# EAGLE schematic medipix (EAGLE 6.4)
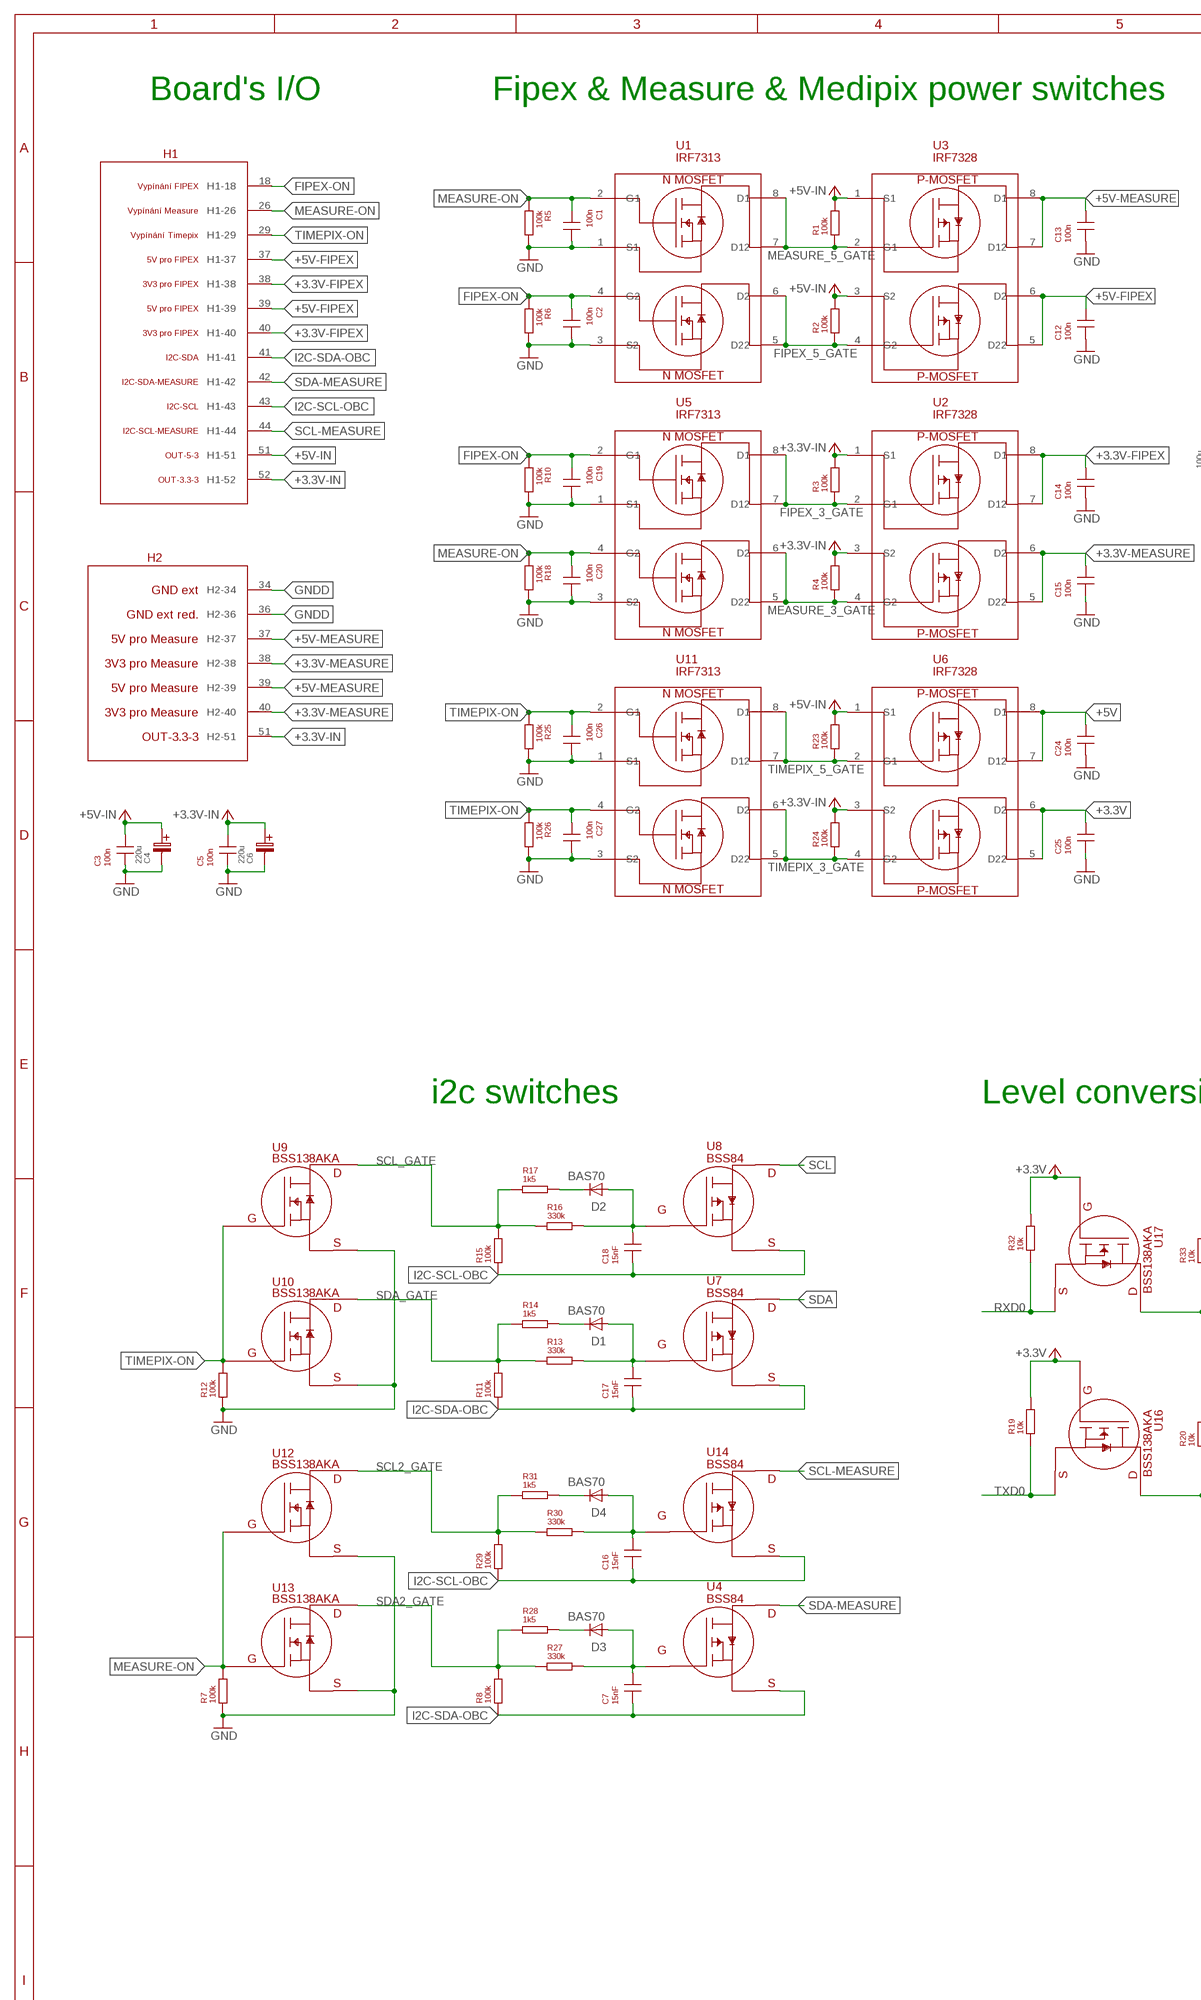
[diagram p0: schematic, sheet 1, part 1 of 2]
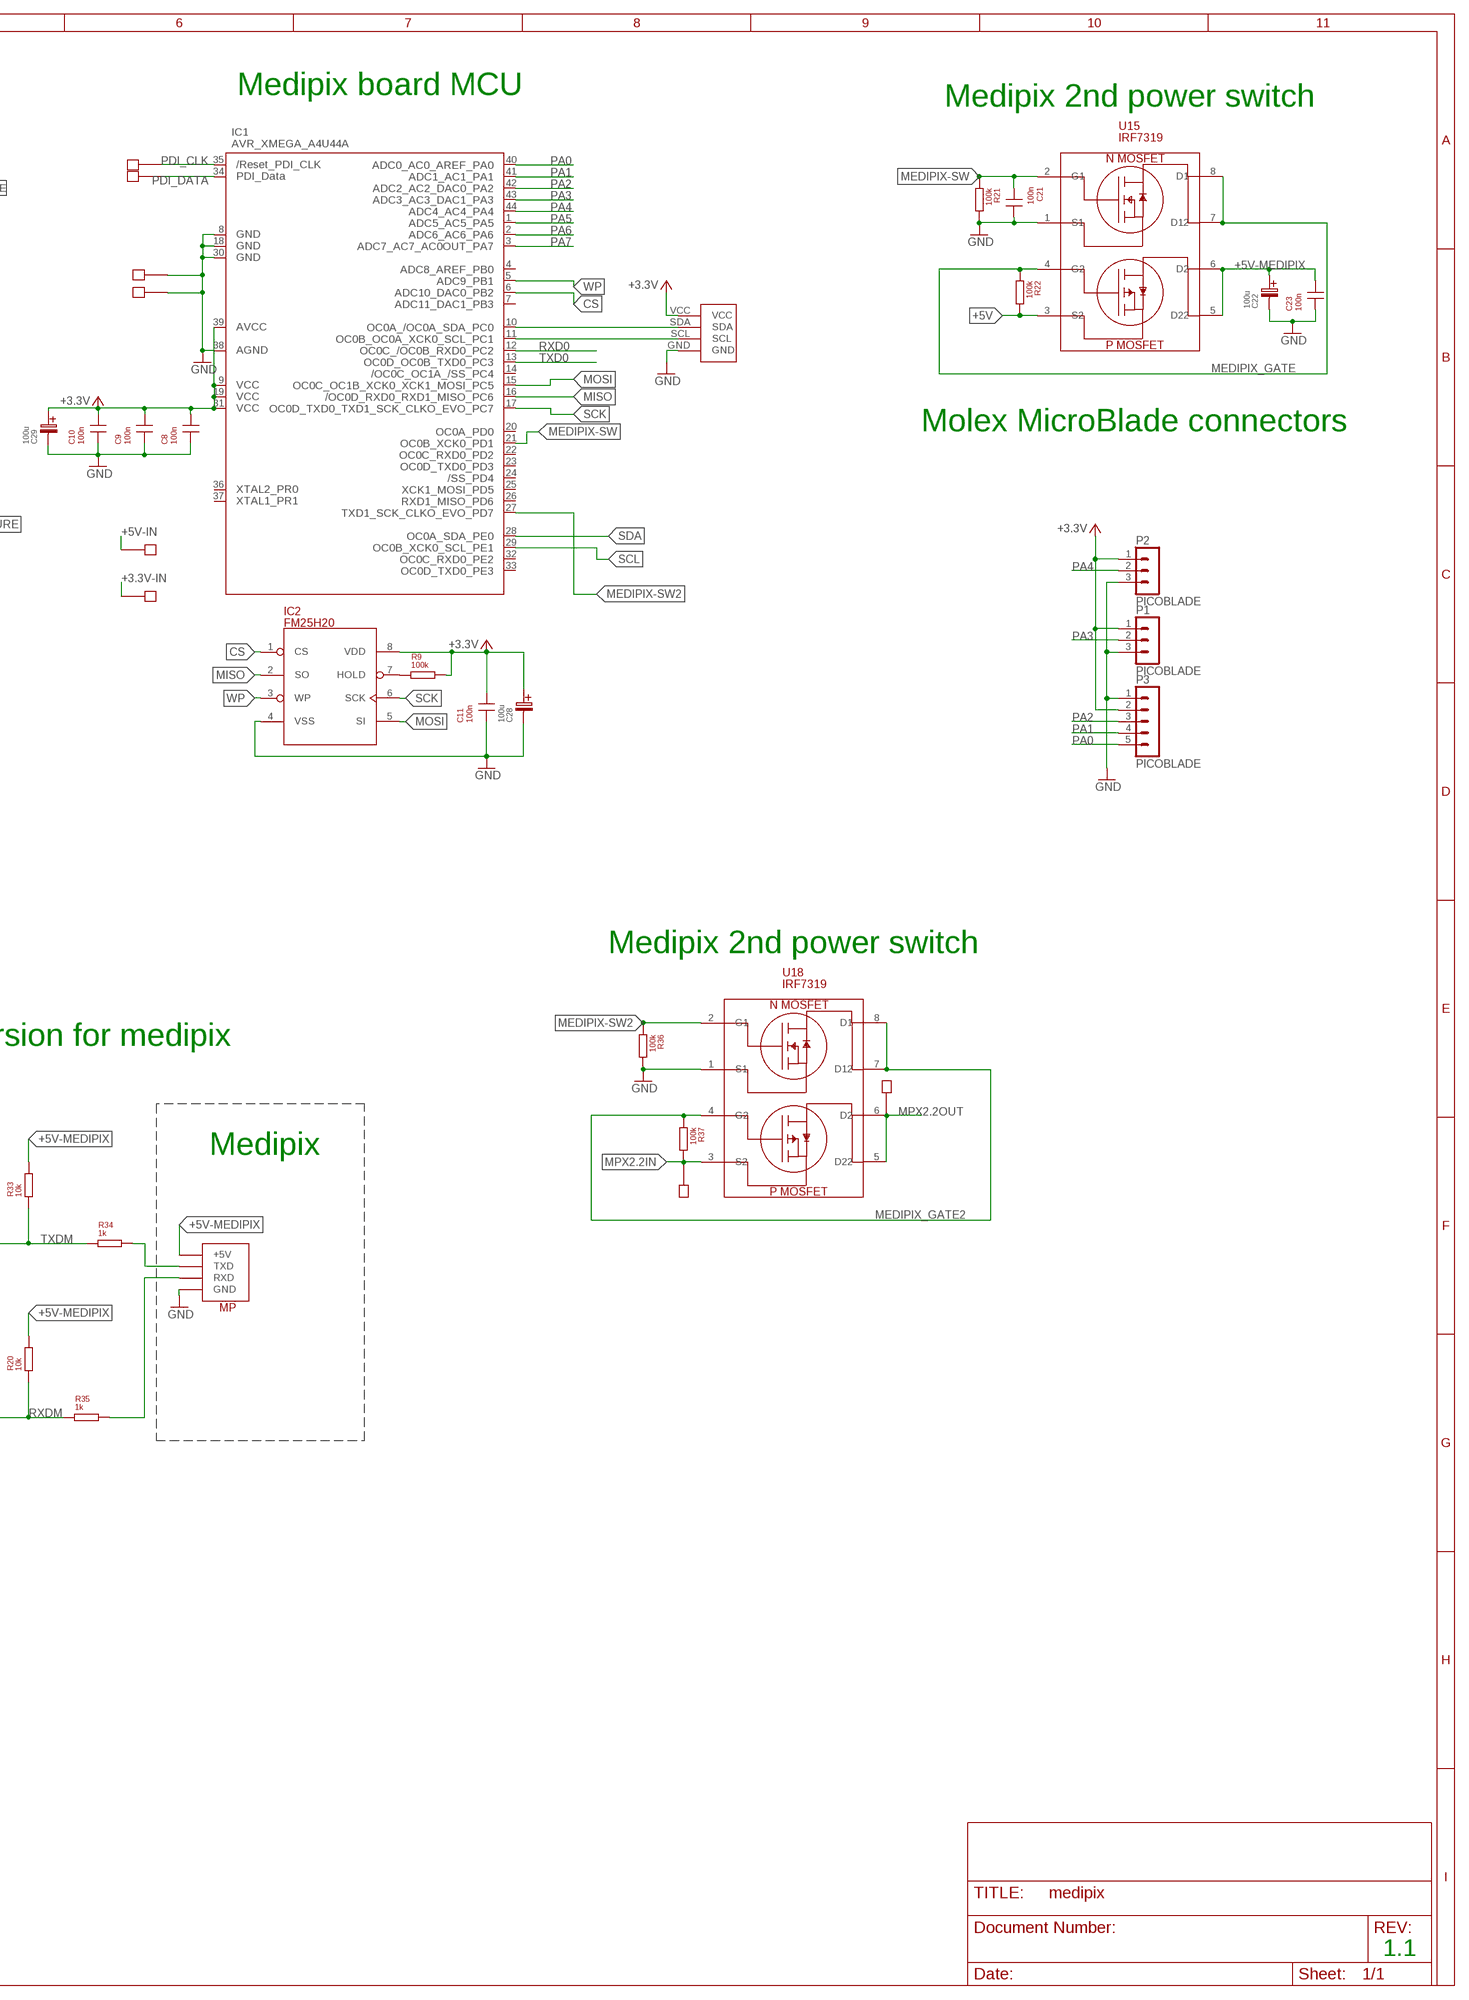
[diagram p1: schematic, sheet 1, part 2 of 2]

## Parts
C1  100n  CAPACITOR_CERAMIC  [R0805]
C2  100n  CAPACITOR_CERAMIC  [R0805]
C3  100n  CAPACITOR_CERAMIC  [R0805]
C4  220u  CAPACITOR_TANTAL_D  [D]
C5  100n  CAPACITOR_CERAMIC  [R0805]
C6  220u  CAPACITOR_TANTAL_D  [D]
C7  15nF  CAPACITOR_CERAMIC  [R0805]
C8  100n  CAPACITOR_CERAMIC  [R0805]
C9  100n  CAPACITOR_CERAMIC  [R0805]
C10  100n  CAPACITOR_CERAMIC  [R0805]
C11  100n  CAPACITOR_CERAMIC  [R0805]
C12  100n  CAPACITOR_CERAMIC  [R0805]
C13  100n  CAPACITOR_CERAMIC  [R0805]
C14  100n  CAPACITOR_CERAMIC  [R0805]
C15  100n  CAPACITOR_CERAMIC  [R0805]
C16  15nF  CAPACITOR_CERAMIC  [R0805]
C17  15nF  CAPACITOR_CERAMIC  [R0805]
C18  15nF  CAPACITOR_CERAMIC  [R0805]
C19  100n  CAPACITOR_CERAMIC  [R0805]
C20  100n  CAPACITOR_CERAMIC  [R0805]
C21  100n  CAPACITOR_CERAMIC  [R0805]
C22  100u  CAPACITOR_TANTAL_B  [SMC_B]
C23  100n  CAPACITOR_CERAMIC  [R0805]
C24  100n  CAPACITOR_CERAMIC  [R0805]
C25  100n  CAPACITOR_CERAMIC  [R0805]
C26  100n  CAPACITOR_CERAMIC  [R0805]
C27  100n  CAPACITOR_CERAMIC  [R0805]
C28  100u  CAPACITOR_TANTAL_B  [SMC_B]
C29  100u  CAPACITOR_TANTAL_B  [SMC_B]
CLK  CLK  PIN  [PIN]
D1  BAS70  [SOD523]
D2  BAS70  [SOD523]
D3  BAS70  [SOD523]
D4  BAS70  [SOD523]
DATA  DATA  PIN  [PIN]
GND  GND  PIN  [PIN]
GND1  GND  PIN  [PIN]
GND25  +3.3  PIN  [PIN]
GND28  +5  PIN  [PIN]
H1  H1  [H-KONEKTOR]
H2  H2  [H-KONEKTOR]
IC1  AVR_XMEGA_A4U44A  [TQFP44]
IC2  FM25H20  [SOIC08]
MP  MEDIPIX_CONNECTOR  [MEDIPIX_CONNECTOR]
P1  PICOBLADE  53398-0310  [53398-0310]
P2  PICOBLADE  53398-0310  [53398-0310]
P3  PICOBLADE  53398-0510  [53398-0510]
R1  100k  RESISTOR0805  [R0805]
R2  100k  RESISTOR0805  [R0805]
R3  100k  RESISTOR0805  [R0805]
R4  100k  RESISTOR0805  [R0805]
R5  100k  RESISTOR0805  [R0805]
R6  100k  RESISTOR0805  [R0805]
R7  100k  RESISTOR0805  [R0805]
R8  100k  RESISTOR0805  [R0805]
R9  100k  RESISTOR0805  [R0805]
R10  100k  RESISTOR0805  [R0805]
R11  100k  RESISTOR0805  [R0805]
R12  100k  RESISTOR0805  [R0805]
R13  330k  RESISTOR0805  [R0805]
R14  1k5  RESISTOR0805  [R0805]
R15  100k  RESISTOR0805  [R0805]
R16  330k  RESISTOR0805  [R0805]
R17  1k5  RESISTOR0805  [R0805]
R18  100k  RESISTOR0805  [R0805]
R19  10k  RESISTOR0805  [R0805]
R20  10k  RESISTOR0805  [R0805]
R21  100k  RESISTOR0805  [R0805]
R22  100k  RESISTOR0805  [R0805]
R23  100k  RESISTOR0805  [R0805]
R24  100k  RESISTOR0805  [R0805]
R25  100k  RESISTOR0805  [R0805]
R26  100k  RESISTOR0805  [R0805]
R27  330k  RESISTOR0805  [R0805]
R28  1k5  RESISTOR0805  [R0805]
R29  100k  RESISTOR0805  [R0805]
R30  330k  RESISTOR0805  [R0805]
R31  1k5  RESISTOR0805  [R0805]
R32  10k  RESISTOR0805  [R0805]
R33  10k  RESISTOR0805  [R0805]
R34  1k  RESISTOR0805  [R0805]
R35  1k  RESISTOR0805  [R0805]
R36  100k  RESISTOR0805  [R0805]
R37  100k  RESISTOR0805  [R0805]
TXD1  IN  PIN  [PIN]
TXD2  OUT  PIN  [PIN]
U1  IRF7313  [SOIC08]
U2  IRF7328  [SOIC08]
U3  IRF7328  [SOIC08]
U4  BSS84  [SOT-23]
U5  IRF7313  [SOIC08]
U6  IRF7328  [SOIC08]
U7  BSS84  [SOT-23]
U8  BSS84  [SOT-23]
U9  BSS138AKA  [SOT-23]
U10  BSS138AKA  [SOT-23]
U11  IRF7313  [SOIC08]
U12  BSS138AKA  [SOT-23]
U13  BSS138AKA  [SOT-23]
U14  BSS84  [SOT-23]
U15  IRF7319  [SOIC08]
U16  BSS138AKA  [SOT-23]
U17  BSS138AKA  [SOT-23]
U18  IRF7319  [SOIC08]
U$1  THERM  [THERM]

## Nets
+3.3V: C8.2 C9.2 C10.2 C11.2 C25.2 C28.+(C_EL+) C29.+(C_EL+) IC1.9(VCC1) IC1.19(VCC2) IC1.31(VCC3) IC1.39(AVCC) IC2.8(VDD) P1.1 P2.1 P3.2 R9.2 R19.2 R32.2 U6.5(D22) U6.6(D2) U16.1(G) U17.1(G) U$1.VCC
+3.3V-FIPEX: C14.2 H1.38(H1-38) H1.40(H1-40) U2.7(D12) U2.8(D1)
+3.3V-IN: C5.2 C6.+(C_EL+) GND25.P$1(D) H1.52(H1-52) H2.51(H2-51) R3.2 R4.2 R24.2 U2.1(S1) U2.3(S2) U6.3(S2)
+3.3V-MEASURE: C15.2 H2.38(H2-38) H2.40(H2-40) U2.5(D22) U2.6(D2)
+5V: C24.2 R22.2 U6.7(D12) U6.8(D1) U15.3(S2)
+5V-FIPEX: C12.2 H1.37(H1-37) H1.39(H1-39) U3.5(D22) U3.6(D2)
+5V-IN: C3.2 C4.+(C_EL+) GND28.P$1(D) H1.51(H1-51) R1.2 R2.2 R23.2 U3.1(S1) U3.3(S2) U6.1(S1)
+5V-MEASURE: C13.2 H2.37(H2-37) H2.39(H2-39) U3.7(D12) U3.8(D1)
+5V-MEDIPIX: C22.+(C_EL+) C23.2 MP.5V(+5V) R20.2 R33.2 U15.5(D22) U15.6(D2)
CS: IC1.6(PB2) IC2.1(CS)
FIPEX-ON: C2.1 C19.1 H1.18(H1-18) R6.1 R10.1 U1.4(G2) U5.2(G1)
FIPEX_3_GATE: R3.1 U2.2(G1) U5.7(D12) U5.8(D1)
FIPEX_5_GATE: R2.1 U1.5(D22) U1.6(D2) U3.4(G2)
GND: U$1.GND
GNDD: C1.2 C2.2 C3.1 C4.-(C_EL-) C5.1 C6.-(C_EL-) C8.1 C9.1 C10.1 C11.1 C12.1 C13.1 C14.1 C15.1 C19.2 C20.2 C21.2 C22.-(C_EL-) C23.1 C24.1 C25.1 C26.2 C27.2 C28.-(C_EL-) C29.-(C_EL-) GND1.P$1(D) GND.P$1(D) H2.34(H2-34) H2.36(H2-36) IC1.8(GND1) IC1.18(GND2) IC1.30(GND3) IC1.38(AGND) IC2.4(VSS) MP.GND P1.3 P2.3 P3.1 R5.2 R6.2 R7.1 R10.2 R12.1 R18.2 R21.2 R25.2 R26.2 R36.2 U1.1(S1) U1.3(S2) U5.1(S1) U5.3(S2) U9.2(S) U10.2(S) U11.1(S1) U11.3(S2) U12.2(S) U13.2(S) U15.1(S1) U18.1(S1) ; supply symbol labelled GND
I2C-SCL-OBC: C16.1 C18.1 H1.43(H1-43) R15.1 R29.1 U8.2(S) U14.2(S)
I2C-SDA-OBC: C7.1 C17.1 H1.41(H1-41) R8.1 R11.1 U4.2(S) U7.2(S)
MEASURE-ON: C1.1 C20.1 H1.26(H1-26) R5.1 R7.2 R18.1 U1.2(G1) U5.4(G2) U12.1(G) U13.1(G)
MEASURE_3_GATE: R4.1 U2.4(G2) U5.5(D22) U5.6(D2)
MEASURE_5_GATE: R1.1 U1.7(D12) U1.8(D1) U3.2(G1)
MEDIPIX-SW: C21.1 IC1.21(PD1) R21.1 U15.2(G1)
MEDIPIX-SW2: IC1.27(PD7) R36.1 U18.2(G1)
MEDIPIX_GATE: R22.1 U15.4(G2) U15.7(D12) U15.8(D1)
MEDIPIX_GATE2: R37.1 U18.4(G2) U18.7(D12) U18.8(D1)
MISO: IC1.16(PC6) IC2.2(SO)
MOSI: IC1.15(PC5) IC2.5(SI)
MPX2.2IN: R37.2 TXD1.P$1(D) U18.3(S2)
MPX2.2OUT: TXD2.P$1(D) U18.5(D22) U18.6(D2)
N$2: D3.C R28.2
N$3: C7.2 D3.A R27.2 U4.1(G)
N$4: D2.C R17.2
N$5: D1.C R14.2
N$6: C17.2 D1.A R13.2 U7.1(G)
N$7: C18.2 D2.A R16.2 U8.1(G)
N$8: IC2.7(HOLD) R9.1
N$9: MP.P$4(TXD) R34.2
N$12: IC1.11(PC1) U$1.SCL
N$13: IC1.10(PC0) U$1.SDA
N$17: D4.C R31.2
N$18: C16.2 D4.A R30.2 U14.1(G)
PA0: IC1.40(PA0) P3.5
PA1: IC1.41(PA1) P3.4
PA2: IC1.42(PA2) P3.3
PA3: IC1.43(PA3) P1.2
PA4: IC1.44(PA4) P2.2
PA5: IC1.1(PA5)
PA6: IC1.2(PA6)
PA7: IC1.3(PA7)
PDI_CLK: CLK.P$1(D) IC1.35(RESET)
PDI_DATA: DATA.P$1(D) IC1.34(PDI_DATA)
RXD0: IC1.12(PC2) R32.1 U17.2(S)
RXDM: R20.1 R35.1 U16.3(D)
RXDMMM: MP.P$3(RXD) R35.2
SCK: IC1.17(PC7) IC2.6(SCK)
SCL: IC1.29(PE1) U8.3(D)
SCL2_GATE: R29.2 R30.1 R31.1 U12.3(D)
SCL-MEASURE: H1.44(H1-44) U14.3(D)
SCL_GATE: R15.2 R16.1 R17.1 U9.3(D)
SDA: IC1.28(PE0) U7.3(D)
SDA2_GATE: R8.2 R27.1 R28.1 U13.3(D)
SDA-MEASURE: H1.42(H1-42) U4.3(D)
SDA_GATE: R11.2 R13.1 R14.1 U10.3(D)
TIMEPIX-ON: C26.1 C27.1 H1.29(H1-29) R12.2 R25.1 R26.1 U9.1(G) U10.1(G) U11.2(G1) U11.4(G2)
TIMEPIX_3_GATE: R24.1 U6.4(G2) U11.5(D22) U11.6(D2)
TIMEPIX_5_GATE: R23.1 U6.2(G1) U11.7(D12) U11.8(D1)
TXD0: IC1.13(PC3) R19.1 U16.2(S)
TXDM: R33.1 R34.1 U17.3(D)
WP: IC1.5(PB1) IC2.3(WP)
Unconnected: IC1.4(PB0) IC1.7(PB3) IC1.14(PC4) IC1.20(PD0) IC1.22(PD2) IC1.23(PD3) IC1.24(PD4) IC1.25(PD5) IC1.26(PD6) IC1.32(PE2) IC1.33(PE3) IC1.36(PR0) IC1.37(PR1)

## Notes on the sheet
- Board's I/O | Fipex & Measure & Medipix power switches | Medipix board MCU
- Medipix 2nd power switch
- Molex MicroBlade connectors
- Medipix 2nd power switch
- i2c switches | Level conversion for medipix
- Medipix
- 1.1

## Library data of the parts
C1-C3 C5 C7-C21 C23-C27 = medipix:CAPACITOR_CERAMIC
C4 C6 C22 C28 C29 = medipix:CAPACITOR_TANTAL
CLK DATA GND GND1 GND25 GND28 TXD1 TXD2 = medipix:PIN
D1-D4 = medipix:BAS70: Schotky DIODE
H1 = medipix:H1
H2 = medipix:H2
IC1 = medipix:AVR_XMEGA_A4U: Device for Atmel AVR XMEGA A4 Series
IC2 = medipix:FM25H20: CYPRESS FRAM
MP = medipix:MEDIPIX_CONNECTOR
P1 P2 = con-molex-picoblade:53398-0310: HEADER
P3 = con-molex-picoblade:53398-0510: HEADER
R1-R37 = medipix:RESISTOR: Resistor
U1 U5 U11 = medipix:IRF7313: DUAL N MOSFET
U2 U3 U6 = medipix:IRF7328: DUAL P MOSFET
U4 U7 U8 U14 = medipix:BSS84: P MOSFET
U9 U10 U12 U13 U16 U17 = medipix:BSS138AKA: N MOSFET
U15 U18 = medipix:IRF7319: N/P MOSFET
U$1 = medipix:THERM